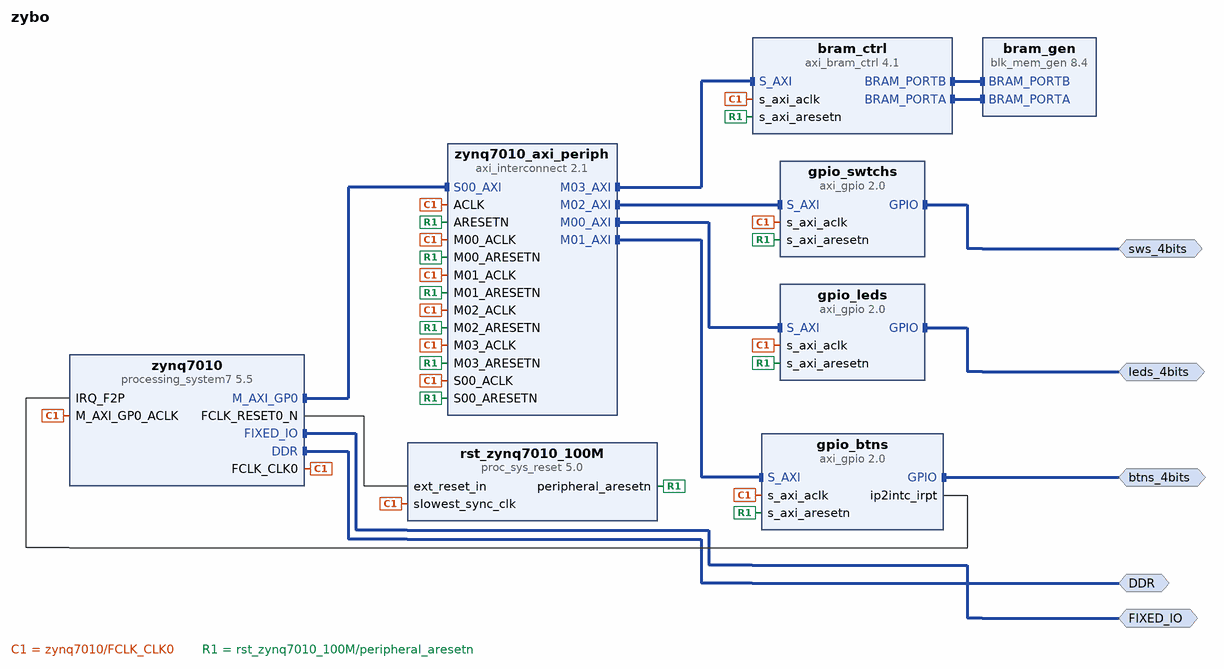
[diagram p0: block diagram of the top level]
# Vivado block design zybo, xc7z010clg400-1, Vivado 2019.2
create_bd_design zybo

create_bd_intf_port -mode Master -vlnv xilinx.com:interface:ddrx_rtl:1.0 DDR
create_bd_intf_port -mode Master -vlnv xilinx.com:display_processing_system7:fixedio_rtl:1.0 FIXED_IO
create_bd_intf_port -mode Master -vlnv xilinx.com:interface:gpio_rtl:1.0 leds_4bits
create_bd_intf_port -mode Master -vlnv xilinx.com:interface:gpio_rtl:1.0 btns_4bits
create_bd_intf_port -mode Master -vlnv xilinx.com:interface:gpio_rtl:1.0 sws_4bits

create_bd_cell -type ip -vlnv xilinx.com:ip:processing_system7:5.5 zynq7010
set_property -dict [list \
  CONFIG.PCW_APU_PERIPHERAL_FREQMHZ 650 \
  CONFIG.PCW_CRYSTAL_PERIPHERAL_FREQMHZ 50.000000 \
  CONFIG.PCW_ENET0_PERIPHERAL_ENABLE 0 \
  CONFIG.PCW_FPGA0_PERIPHERAL_FREQMHZ 100 \
  CONFIG.PCW_FPGA1_PERIPHERAL_FREQMHZ 50 \
  CONFIG.PCW_GP0_EN_MODIFIABLE_TXN 0 \
  CONFIG.PCW_GP1_EN_MODIFIABLE_TXN 0 \
  CONFIG.PCW_GPIO_MIO_GPIO_ENABLE 0 \
  CONFIG.PCW_IRQ_F2P_INTR 1 \
  CONFIG.PCW_PERIPHERAL_BOARD_PRESET part0 \
  CONFIG.PCW_PRESET_BANK1_VOLTAGE {LVCMOS 1.8V} \
  CONFIG.PCW_QSPI_PERIPHERAL_ENABLE 0 \
  CONFIG.PCW_SD0_PERIPHERAL_ENABLE 0 \
  CONFIG.PCW_SDIO_PERIPHERAL_FREQMHZ 50 \
  CONFIG.PCW_UART1_PERIPHERAL_ENABLE 1 \
  CONFIG.PCW_UART1_UART1_IO {MIO 48 .. 49} \
  CONFIG.PCW_UART_PERIPHERAL_FREQMHZ 100 \
  CONFIG.PCW_UIPARAM_DDR_FREQ_MHZ 525 \
  CONFIG.PCW_UIPARAM_DDR_PARTNO {MT41K128M16 JT-125} \
  CONFIG.PCW_USB0_PERIPHERAL_ENABLE 0 \
  CONFIG.PCW_USE_FABRIC_INTERRUPT 1 \
] [get_bd_cells zynq7010]
# 352 more settings of zynq7010 are not shown: defaults, MIO pin electricals, DDR timing, and values the tool derives
create_bd_cell -type ip -vlnv xilinx.com:ip:axi_gpio:2.0 gpio_leds
set_property -dict {CONFIG.GPIO_BOARD_INTERFACE leds_4bits CONFIG.USE_BOARD_FLOW true} [get_bd_cells gpio_leds]
create_bd_cell -type ip -vlnv xilinx.com:ip:axi_interconnect:2.1 zynq7010_axi_periph
set_property -dict {CONFIG.NUM_MI 4} [get_bd_cells zynq7010_axi_periph]
create_bd_cell -type ip -vlnv xilinx.com:ip:proc_sys_reset:5.0 rst_zynq7010_100M
create_bd_cell -type ip -vlnv xilinx.com:ip:axi_gpio:2.0 gpio_btns
set_property -dict [list \
  CONFIG.C_INTERRUPT_PRESENT 1 \
  CONFIG.C_IS_DUAL 0 \
  CONFIG.GPIO2_BOARD_INTERFACE Custom \
  CONFIG.GPIO_BOARD_INTERFACE btns_4bits \
  CONFIG.USE_BOARD_FLOW true \
] [get_bd_cells gpio_btns]
create_bd_cell -type ip -vlnv xilinx.com:ip:axi_gpio:2.0 gpio_swtchs
set_property -dict {CONFIG.GPIO_BOARD_INTERFACE sws_4bits} [get_bd_cells gpio_swtchs]
create_bd_cell -type ip -vlnv xilinx.com:ip:axi_bram_ctrl:4.1 bram_ctrl
create_bd_cell -type ip -vlnv xilinx.com:ip:blk_mem_gen:8.4 bram_gen
set_property -dict {CONFIG.Memory_Type True_Dual_Port_RAM} [get_bd_cells bram_gen]

# ---- connections ----

connect_bd_intf_net -intf_net processing_system7_0_FIXED_IO [get_bd_intf_ports FIXED_IO] [get_bd_intf_pins zynq7010/FIXED_IO]
connect_bd_intf_net -intf_net processing_system7_0_DDR [get_bd_intf_ports DDR] [get_bd_intf_pins zynq7010/DDR]
connect_bd_intf_net [get_bd_intf_pins zynq7010/M_AXI_GP0] [get_bd_intf_pins zynq7010_axi_periph/S00_AXI]
connect_bd_intf_net [get_bd_intf_pins zynq7010_axi_periph/M02_AXI] [get_bd_intf_pins gpio_swtchs/S_AXI]
connect_bd_intf_net [get_bd_intf_pins zynq7010_axi_periph/M00_AXI] [get_bd_intf_pins gpio_leds/S_AXI]
connect_bd_intf_net -intf_net axi_gpio_0_GPIO1 [get_bd_intf_ports btns_4bits] [get_bd_intf_pins gpio_btns/GPIO]
connect_bd_intf_net -intf_net axi_gpio_0_GPIO [get_bd_intf_ports leds_4bits] [get_bd_intf_pins gpio_leds/GPIO]
connect_bd_intf_net [get_bd_intf_pins zynq7010_axi_periph/M01_AXI] [get_bd_intf_pins gpio_btns/S_AXI]
connect_bd_intf_net -intf_net axi_gpio_0_GPIO2 [get_bd_intf_ports sws_4bits] [get_bd_intf_pins gpio_swtchs/GPIO]
connect_bd_intf_net [get_bd_intf_pins zynq7010_axi_periph/M03_AXI] [get_bd_intf_pins bram_ctrl/S_AXI]
connect_bd_intf_net [get_bd_intf_pins bram_gen/BRAM_PORTB] [get_bd_intf_pins bram_ctrl/BRAM_PORTB]
connect_bd_intf_net [get_bd_intf_pins bram_gen/BRAM_PORTA] [get_bd_intf_pins bram_ctrl/BRAM_PORTA]
connect_bd_net [get_bd_pins zynq7010/FCLK_CLK0] \
  [get_bd_pins zynq7010/M_AXI_GP0_ACLK] [get_bd_pins zynq7010_axi_periph/S00_ACLK] \
  [get_bd_pins rst_zynq7010_100M/slowest_sync_clk] [get_bd_pins gpio_leds/s_axi_aclk] \
  [get_bd_pins zynq7010_axi_periph/M00_ACLK] [get_bd_pins zynq7010_axi_periph/ACLK] [get_bd_pins gpio_btns/s_axi_aclk] \
  [get_bd_pins zynq7010_axi_periph/M01_ACLK] [get_bd_pins gpio_swtchs/s_axi_aclk] [get_bd_pins zynq7010_axi_periph/M02_ACLK] \
  [get_bd_pins bram_ctrl/s_axi_aclk] [get_bd_pins zynq7010_axi_periph/M03_ACLK]
connect_bd_net [get_bd_pins zynq7010/FCLK_RESET0_N] [get_bd_pins rst_zynq7010_100M/ext_reset_in]
connect_bd_net [get_bd_pins rst_zynq7010_100M/peripheral_aresetn] \
  [get_bd_pins zynq7010_axi_periph/S00_ARESETN] [get_bd_pins gpio_leds/s_axi_aresetn] \
  [get_bd_pins zynq7010_axi_periph/M00_ARESETN] [get_bd_pins zynq7010_axi_periph/ARESETN] \
  [get_bd_pins gpio_btns/s_axi_aresetn] [get_bd_pins zynq7010_axi_periph/M01_ARESETN] [get_bd_pins gpio_swtchs/s_axi_aresetn] \
  [get_bd_pins zynq7010_axi_periph/M02_ARESETN] [get_bd_pins bram_ctrl/s_axi_aresetn] \
  [get_bd_pins zynq7010_axi_periph/M03_ARESETN]
connect_bd_net [get_bd_pins gpio_btns/ip2intc_irpt] [get_bd_pins zynq7010/IRQ_F2P]
set_property HDL_ATTRIBUTE.BMM_INFO_PROCESSOR {arm > zybo bram_ctrl} [get_bd_cells zynq7010]
set_property HDL_ATTRIBUTE.KEEP_HIERARCHY yes [get_bd_cells zynq7010]
set_property HDL_ATTRIBUTE.BMM_INFO_ADDRESS_SPACE {byte  0x40000000 32 > zybo bram_gen} [get_bd_cells bram_ctrl]
set_property HDL_ATTRIBUTE.KEEP_HIERARCHY yes [get_bd_cells bram_ctrl]

# ---- address map ----
assign_bd_address -offset 0x40000000 -range 8K -target_address_space [get_bd_addr_spaces zynq7010/Data] [get_bd_addr_segs bram_ctrl/S_AXI/Mem0]
assign_bd_address -offset 0x41200000 -range 64K -target_address_space [get_bd_addr_spaces zynq7010/Data] [get_bd_addr_segs gpio_leds/S_AXI/Reg]
assign_bd_address -offset 0x41210000 -range 64K -target_address_space [get_bd_addr_spaces zynq7010/Data] [get_bd_addr_segs gpio_btns/S_AXI/Reg]
assign_bd_address -offset 0x41220000 -range 64K -target_address_space [get_bd_addr_spaces zynq7010/Data] [get_bd_addr_segs gpio_swtchs/S_AXI/Reg]

validate_bd_design
save_bd_design
